# Altium schematic sheet Wheatstone bridge part II (Main).SchDoc: Wheatstone bridge part II
size A4; Revision: 1; SheetNumber: 4; SheetTotal: 5; Units: mm
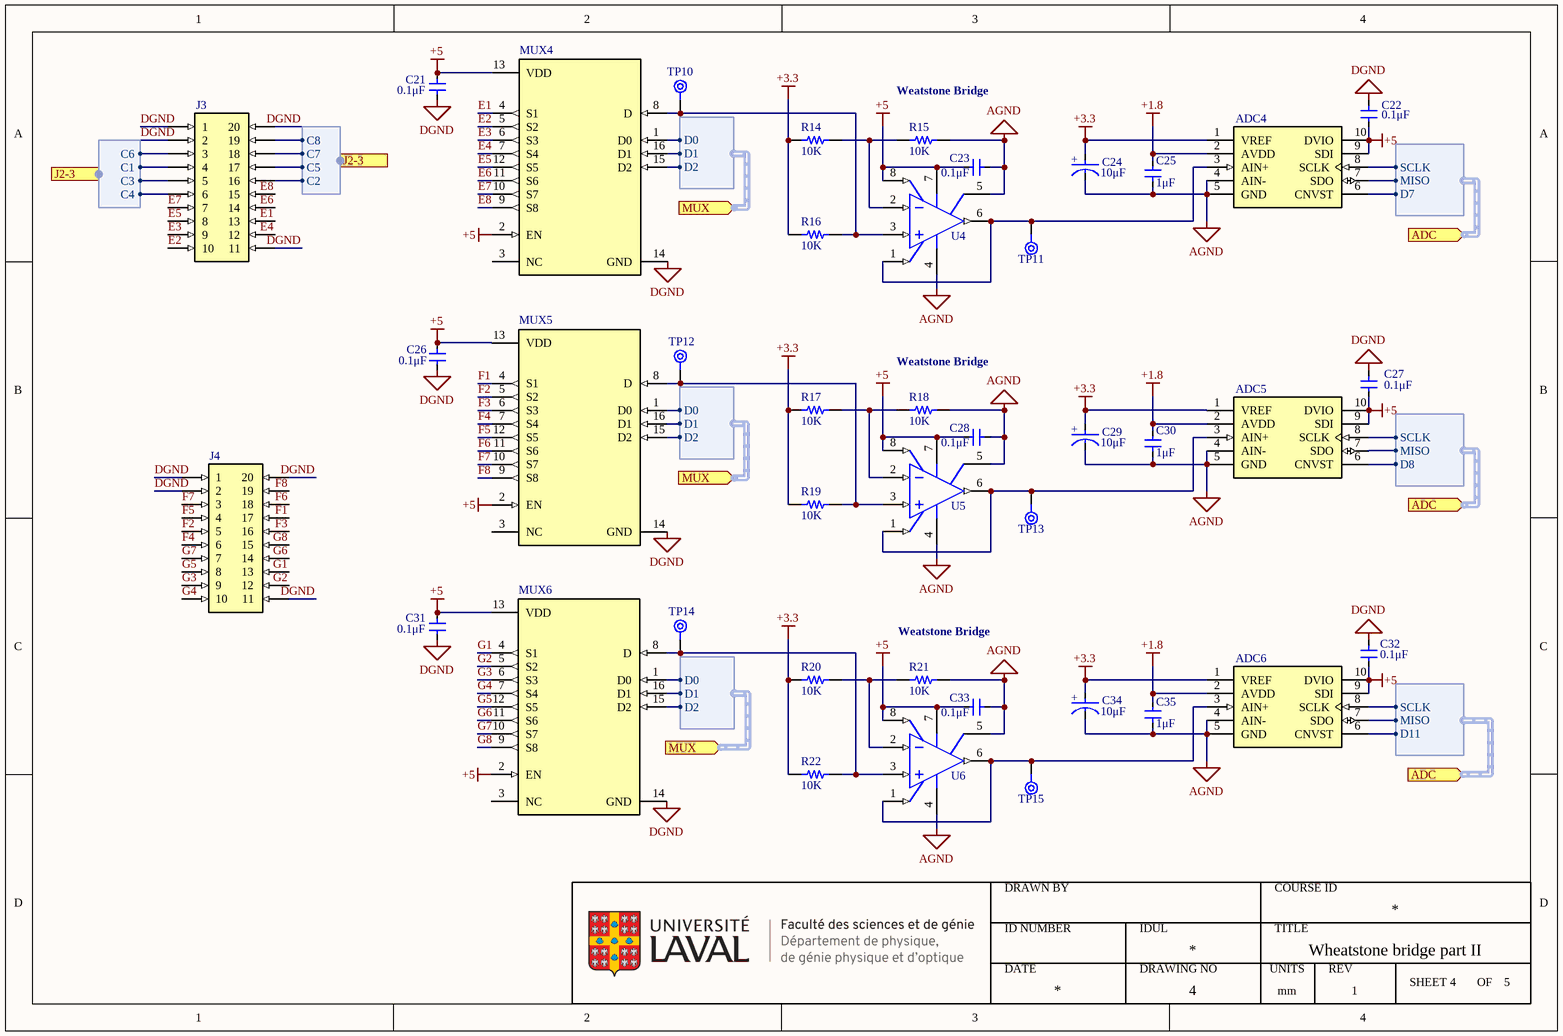
[diagram p0: Wheatstone bridge part II (Main).SchDoc]

## Parts
ADC4  (no value)  [MCP33141-10-E/MS]
ADC5  (no value)  [MCP33141-10-E/MS]
ADC6  (no value)  [MCP33141-10-E/MS]
C21  Capacitance: 0.1μF  [Cap Ceramic 0.1 uF 50V SMT 0603]  (hidden comment: Cap Ceramic 0.1 uF SMT 0603)
C22  Capacitance: 0.1μF  [Cap Ceramic 0.1 uF 50V SMT 0603]  (hidden comment: CC0603JRX7R9BB104)
C23  Capacitance: 0.1μF  [Cap Ceramic 0.1 uF 50V SMT 0603]  (hidden comment: Cap Ceramic 0.1 uF SMT 0603)
C24  value 10μF  [Cap Tantalum 10 uF 16V SMT 1411]  (hidden comment: Cap 10 uF 16V Tantalum 1411)
C25  value 1μF  [Cap Ceramic 1 uF 16V SMT 0603]  (hidden comment: Cap Ceramic 1 uF SMT 0603)
C26  Capacitance: 0.1μF  [Cap Ceramic 0.1 uF 50V SMT 0603]  (hidden comment: Cap Ceramic 0.1 uF SMT 0603)
C27  Capacitance: 0.1μF  [Cap Ceramic 0.1 uF 50V SMT 0603]  (hidden comment: CC0603JRX7R9BB104)
C28  Capacitance: 0.1μF  [Cap Ceramic 0.1 uF 50V SMT 0603]  (hidden comment: Cap Ceramic 0.1 uF SMT 0603)
C29  value 10μF  [Cap Tantalum 10 uF 16V SMT 1411]  (hidden comment: Cap 10 uF 16V Tantalum 1411)
C30  value 1μF  [Cap Ceramic 1 uF 16V SMT 0603]  (hidden comment: Cap Ceramic 1 uF SMT 0603)
C31  Capacitance: 0.1μF  [Cap Ceramic 0.1 uF 50V SMT 0603]  (hidden comment: Cap Ceramic 0.1 uF SMT 0603)
C32  Capacitance: 0.1μF  [Cap Ceramic 0.1 uF 50V SMT 0603]  (hidden comment: CC0603JRX7R9BB104)
C33  Capacitance: 0.1μF  [Cap Ceramic 0.1 uF 50V SMT 0603]  (hidden comment: Cap Ceramic 0.1 uF SMT 0603)
C34  value 10μF  [Cap Tantalum 10 uF 16V SMT 1411]  (hidden comment: Cap 10 uF 16V Tantalum 1411)
C35  value 1μF  [Cap Ceramic 1 uF 16V SMT 0603]  (hidden comment: Cap Ceramic 1 uF SMT 0603)
J3  BF050-20-A-B-0400-0300-L-G  [Headers 20 Pos TH 0.079" 4-3 - A]  (value not drawn)
J4  BF050-20-A-B-0400-0300-L-G  [Headers 20 Pos TH 0.079" 4-3 - A]  (value not drawn)
MUX4  TMUX1208PWR  [TMUX1208PWR]  (value not drawn)
MUX5  TMUX1208PWR  [TMUX1208PWR]  (value not drawn)
MUX6  TMUX1208PWR  [TMUX1208PWR]  (value not drawn)
R14  value 10K  [Res 10K 0.1% SMT 0603]  (hidden comment: Res 10K SMT 0603)
R15  value 10K  [Res 10K 0.1% SMT 0603]  (hidden comment: Res 10K SMT 0603)
R16  value 10K  [Res 10K 0.1% SMT 0603]  (hidden comment: Res 10K SMT 0603)
R17  value 10K  [Res 10K 0.1% SMT 0603]  (hidden comment: Res 10K SMT 0603)
R18  value 10K  [Res 10K 0.1% SMT 0603]  (hidden comment: Res 10K SMT 0603)
R19  value 10K  [Res 10K 0.1% SMT 0603]  (hidden comment: Res 10K SMT 0603)
R20  value 10K  [Res 10K 0.1% SMT 0603]  (hidden comment: Res 10K SMT 0603)
R21  value 10K  [Res 10K 0.1% SMT 0603]  (hidden comment: Res 10K SMT 0603)
R22  value 10K  [Res 10K 0.1% SMT 0603]  (hidden comment: Res 10K SMT 0603)
TP10  Test Point  [SQ Pad]  (value not drawn)  (no BOM)
TP11  Test Point  [SQ Pad]  (value not drawn)  (no BOM)
TP12  Test Point  [SQ Pad]  (value not drawn)  (no BOM)
TP13  Test Point  [SQ Pad]  (value not drawn)  (no BOM)
TP14  Test Point  [SQ Pad]  (value not drawn)  (no BOM)
TP15  Test Point  [SQ Pad]  (value not drawn)  (no BOM)
U4  Instrumentation Op Amp 35 MHz 8 pins  [MCP6N11-100E/SN]  (value not drawn)
U5  Instrumentation Op Amp 35 MHz 8 pins  [MCP6N11-100E/SN]  (value not drawn)
U6  Instrumentation Op Amp 35 MHz 8 pins  [MCP6N11-100E/SN]  (value not drawn)

## Ports
ADC (in, harness 10), ADC (in, harness 12), ADC (in, harness 14), J2-3 (out, harness J31), J2-3 (out, harness J32), MUX (in, harness 9), MUX (in, harness 11), MUX (in, harness 13)

## Harnesses
11: D0, D1, D2
13: D0, D1, D2
9: D0, D1, D2
10: SCLK, MISO, D7
12: SCLK, MISO, D8
14: SCLK, MISO, D11
J32: C8, C7, C5, C2
J31: C6, C1, C3, C4

## Nets
+1.8: ADC4.2(AVDD) ADC5.2(AVDD) ADC6.2(AVDD) C25.1 C30.1 C35.1
+3.3: ADC4.1(VREF) ADC5.1(VREF) ADC6.1(VREF) C24.2(A) C29.2(A) C34.2(A) R14.1 R16.1 R17.1 R19.1 R20.1 R22.1
+5: ADC4.9(SDI) ADC4.10(DVIO) ADC5.9(SDI) ADC5.10(DVIO) ADC6.9(SDI) ADC6.10(DVIO) C21.2 C22.1 C23.1 C26.2 C27.1 C28.1 C31.2 C32.1 C33.1 MUX4.2(EN) MUX4.13(VDD) MUX5.2(EN) MUX5.13(VDD) MUX6.2(EN) MUX6.13(VDD) U4.7(VDD) U4.8(EN/~{CAL}) U5.7(VDD) U5.8(EN/~{CAL}) U6.7(VDD) U6.8(EN/~{CAL})
AGND: ADC4.4(AIN-) ADC4.5(GND) ADC5.4(AIN-) ADC5.5(GND) ADC6.4(AIN-) ADC6.5(GND) C23.2 C24.1(C) C25.2 C28.2 C29.1(C) C30.2 C33.2 C34.1(C) C35.2 R15.2 R18.2 R21.2 U4.4(VSS) U4.5(VREF) U5.4(VSS) U5.5(VREF) U6.4(VSS) U6.5(VREF)
DGND: C21.1 C22.2 C26.1 C27.2 C31.1 C32.2 J3.1 J3.2 J3.11 J3.20 J4.1 J4.2 J4.11 J4.20 MUX4.14(GND) MUX5.14(GND) MUX6.14(GND)
E1: J3.13 MUX4.4(S1)
E2: J3.10 MUX4.5(S2)
E3: J3.9 MUX4.6(S3)
E4: J3.12 MUX4.7(S4)
E5: J3.8 MUX4.12(S5)
E6: J3.14 MUX4.11(S6)
E7: J3.7 MUX4.10(S7)
E8: J3.15 MUX4.9(S8)
F1: J4.17 MUX5.4(S1)
F2: J4.5 MUX5.5(S2)
F3: J4.16 MUX5.6(S3)
F4: J4.6 MUX5.7(S4)
F5: J4.4 MUX5.12(S5)
F6: J4.18 MUX5.11(S6)
F7: J4.3 MUX5.10(S7)
F8: J4.19 MUX5.9(S8)
G1: J4.13 MUX6.4(S1)
G2: J4.12 MUX6.5(S2)
G3: J4.9 MUX6.6(S3)
G4: J4.10 MUX6.7(S4)
G5: J4.8 MUX6.12(S5)
G6: J4.14 MUX6.11(S6)
G7: J4.7 MUX6.10(S7)
G8: J4.15 MUX6.9(S8)
NetADC4_3: ADC4.3(AIN+) TP11.1(TP) U4.1(VFG) U4.6(VOUT)
NetADC4_6: ADC4.6(CNVST) ; port ADC.D7
NetADC4_7: ADC4.7(SDO) ADC5.7(SDO) ADC6.7(SDO) ; port ADC.MISO
NetADC4_8: ADC4.8(SCLK) ADC5.8(SCLK) ADC6.8(SCLK) ; port ADC.SCLK
NetADC5_3: ADC5.3(AIN+) TP13.1(TP) U5.1(VFG) U5.6(VOUT)
NetADC5_6: ADC5.6(CNVST) ; port ADC.D8
NetADC6_3: ADC6.3(AIN+) TP15.1(TP) U6.1(VFG) U6.6(VOUT)
NetADC6_6: ADC6.6(CNVST) ; port ADC.D11
NetJ3_3: J3.3 ; port J2-3.C6
NetJ3_4: J3.4 ; port J2-3.C1
NetJ3_5: J3.5 ; port J2-3.C3
NetJ3_6: J3.6 ; port J2-3.C4
NetJ3_16: J3.16 ; port J2-3.C2
NetJ3_17: J3.17 ; port J2-3.C5
NetJ3_18: J3.18 ; port J2-3.C7
NetJ3_19: J3.19 ; port J2-3.C8
NetMUX4_1: MUX4.1(D0) MUX5.1(D0) MUX6.1(D0) ; port MUX.D0
NetMUX4_8: MUX4.8(D) R16.2 TP10.1(TP) U4.3(VIP)
NetMUX4_15: MUX4.15(D2) MUX5.15(D2) MUX6.15(D2) ; port MUX.D2
NetMUX4_16: MUX4.16(D1) MUX5.16(D1) MUX6.16(D1) ; port MUX.D1
NetMUX5_8: MUX5.8(D) R19.2 TP12.1(TP) U5.3(VIP)
NetMUX6_8: MUX6.8(D) R22.2 TP14.1(TP) U6.3(VIP)
NetR14_2: R14.2 R15.1 U4.2(VIM)
NetR17_2: R17.2 R18.1 U5.2(VIM)
NetR20_2: R20.2 R21.1 U6.2(VIM)

Not connected (* = marked no-connect by the designer): MUX4 3(NC); MUX5 3(NC); MUX6 3(NC)

## Notes on the sheet
- (near R15) Weatstone Bridge
- (near R18) Weatstone Bridge
- (near R21) Weatstone Bridge
- DRAWN BY
- COURSE ID
- ID NUMBER
- DATE
- IDUL
- DRAWING NO
- TITLE
- UNITS
- REV
- SHEET
- OF
- (in symbol Cap 10 uF 16V Tantalum 1411) +

## Library data of the parts
ADC4-ADC6 = ADC 12 bits 1MSPS: 12 Bit Analog to Digital Converter 1 Input 1 SAR 10-MSOP; Supplier 1: Digi-Key; Supplier Part Number 1: MCP33141-10-E/MS-ND
C21 C23 C26 C28 C31 C33 = Cap Ceramic 0.1 uF SMT 0603: 0.1 µF ±5% 50V Ceramic Capacitor X7R 0603 (1608 Metric); Part Number: CC0603JRX7R9BB104; manufacturer: Yageo; Applications: General Purpose; componentlink1description: Datasheet; componentlink1url: https://www.yageo.com/upload/media/product/productsearch/datasheet/mlcc/UPY-GPHC_X7R_6.3V-to-50V_18.pdf; componentlink2description: DigiKey Link; componentlink2url: https://www.digikey.com/en/products/detail/yageo/CC0603JRX7R9BB104/5195188; Device Package: 0603 (1608 Metric); lastupdated: 2023-03-06 20:08:09; Lifecycle Status: Active; Minimum Order: 1; Mounting Type: Surface Mount, MLCC; Operating Temperature: -55°C ~ 125°C; Package / Case: 0603 (1608 Metric); packaging: TapeAndReel; partid: 12474; Part Status: Active; price: 0.01; series: CC; Size / Dimension: 0.063" L x 0.031" W (1.60mm x 0.80mm); Temperature Coefficient: X7R; Thickness (Max): 0.035" (0.90mm); Tolerance: ±5%; Voltage - Rated: 50V; Supplier 1: Digi-Key; Supplier Part Number 1: 311-1779-1-ND; Supplier 2: Digi-Key; Supplier Part Number 2: 311-1779-6-ND; Supplier 3: Digi-Key; Supplier Part Number 3: 311-1779-2-ND
C22 C27 C32 = Cap Ceramic 0.1 uF SMT 0603: 0.1 µF ±5% 50V Ceramic Capacitor X7R 0603 (1608 Metric); manufacturer: Yageo; Part Number: CC0603JRX7R9BB104; Applications: General Purpose; componentlink1description: Datasheet; componentlink1url: https://www.yageo.com/upload/media/product/productsearch/datasheet/mlcc/UPY-GPHC_X7R_6.3V-to-50V_18.pdf; componentlink2description: DigiKey Link; componentlink2url: https://www.digikey.com/en/products/detail/yageo/CC0603JRX7R9BB104/5195188; Device Package: 0603 (1608 Metric); lastupdated: 2023-03-06 20:08:09; Lifecycle Status: Active; Minimum Order: 1; Mounting Type: Surface Mount, MLCC; Operating Temperature: -55°C ~ 125°C; Package / Case: 0603 (1608 Metric); packaging: TapeAndReel; partid: 12474; Part Status: Active; price: 0.01; series: CC; Size / Dimension: 0.063" L x 0.031" W (1.60mm x 0.80mm); Temperature Coefficient: X7R; Thickness (Max): 0.035" (0.90mm); Tolerance: ±5%; Voltage - Rated: 50V; Supplier 1: Digi-Key; Supplier Part Number 1: 311-1779-1-ND; Supplier 2: Digi-Key; Supplier Part Number 2: 311-1779-6-ND; Supplier 3: Digi-Key; Supplier Part Number 3: 311-1779-2-ND
C24 C29 C34 = Cap 10 uF 16V Tantalum 1411: 10 µF Molded Tantalum Capacitors 16 V 1411 (3528 Metric) 2Ohm; Voltage Rating: 16V; Case Code (Imperial): 1411; Supplier 1: Digi-Key; Supplier Part Number 1: 718-1124-1-ND; Supplier 2: Digi-Key; Supplier Part Number 2: 718-1124-6-ND; Supplier 3: Digi-Key; Supplier Part Number 3: 718-1124-2-ND
C25 C30 C35 = Cap Ceramic 1 uF SMT 0603: 1 µF ±10% 16V Ceramic Capacitor X7R 0603 (1608 Metric); Dielectric: XR7; Tolerance: 10%; Max Operating Temperature: 125°C; Case Code (Imperial): 0603; Voltage Rating (DC): 16V; Resistor Type: Ceramic; Height: 0.8mm; Length: 1.6mm; Construction: Flat; Termination: SMT/SMD; Min Operating Temperature: -55°C; Supplier 1: Digi-Key; Supplier Part Number 1: 13-CC0603KPX7R7BB105CT-ND; Supplier 2: Digi-Key; Supplier Part Number 2: 13-CC0603KPX7R7BB105DKR-ND; Supplier 3: Digi-Key; Supplier Part Number 3: 13-CC0603KPX7R7BB105TR-ND
J3 J4 = Headers 20 Pos TH 0.079" 4-3: Connector Header Through Hole 20 position 0.079" (2.00mm); Supplier 1: Digi-Key; Supplier Part Number 1: 2073-BF050-20-A-B-0400-0300-L-G-ND
MUX4-MUX6 = MUX Analog 8:1: 5-V, 8: 1, 1-channel general-purpose analog multiplexer with 1.8-V input logic 16-TSSOP -40 to 125; Supplier 1: Digi-Key; Supplier Part Number 1: 296-51847-1-ND; Supplier 2: Digi-Key; Supplier Part Number 2: 296-51847-6-ND; Supplier 3: Digi-Key; Supplier Part Number 3: 296-51847-2-ND; ComponentLink1Description: Datasheet; ComponentLink1URL: https://www.ti.com/lit/ds/symlink/tmux1208.pdf?HQS=dis-dk-null-digikeymode-dsf-pf-null-wwe&ts=1678139087624&ref_url=https%253A%252F%252Fwww.ti.com%252Fgeneral%252Fdocs%252Fsuppproductinfo.tsp%253FdistId%253D10%2526gotoUrl%253Dhttps%253A%252F%252Fwww.ti.com%252Flit%252Fgpn%252Ftmux1208
R14-R22 = Res 10K SMT 0603: 10 kΩ  ±0.1% 0.1W, 1/10W Chip Resistor 0603 (1608 Metric) Thin Film; Part Number: RT0603BRD0710KL; Manufacturer: Yageo; Temperature Coefficient: ±25ppm/°C; ComponentLink1Description: Datasheet; ComponentLink1URL: https://www.yageo.com/upload/media/product/productsearch/datasheet/rchip/PYu-RT_1-to-0.01_RoHS_L_11.pdf; ComponentLink2Description: DigiKey Link; ComponentLink2URL: https://www.digikey.com/en/products/detail/yageo/RT0603BRD0710KL/1072198; Composition: Thin Film; Device Package: 0603 (1608 Metric); Height - Seated (Max): 0.022" (0.55mm); LastUpdated: 2023-03-06 20:27:57; Lifecycle Status: Active; Minimum Order: 1; Number of Terminations: 2; Operating Temperature: -55°C ~ 155°C; Package / Case: 0603 (1608 Metric); Packaging: TapeAndReel; PartId: 22611; Part Status: Active; Power (Watts): 0.1W, 1/10W; Price: 0.03; Resistance: 10K; Series: RT; Size / Dimension: 0.063" L x 0.031" W (1.60mm x 0.80mm); Supplier Device Package: 0603; Tolerance: ±0.1%; Supplier 1: Digi-Key; Supplier Part Number 1: YAG1236CT-ND; Supplier 2: Digi-Key; Supplier Part Number 2: YAG1236DKR-ND; Supplier 3: Digi-Key; Supplier Part Number 3: YAG1236TR-ND
U4-U6 = Instrumentation Op Amp 35 MHz 8 pins: Instrumentation Amplifier 1 Circuit Rail-to-Rail 8-SOIC; Supplier 1: Digi-Key; Supplier Part Number 1: MCP6N11-100E/SN-ND